# Altium project STM_POC.PrjPcb
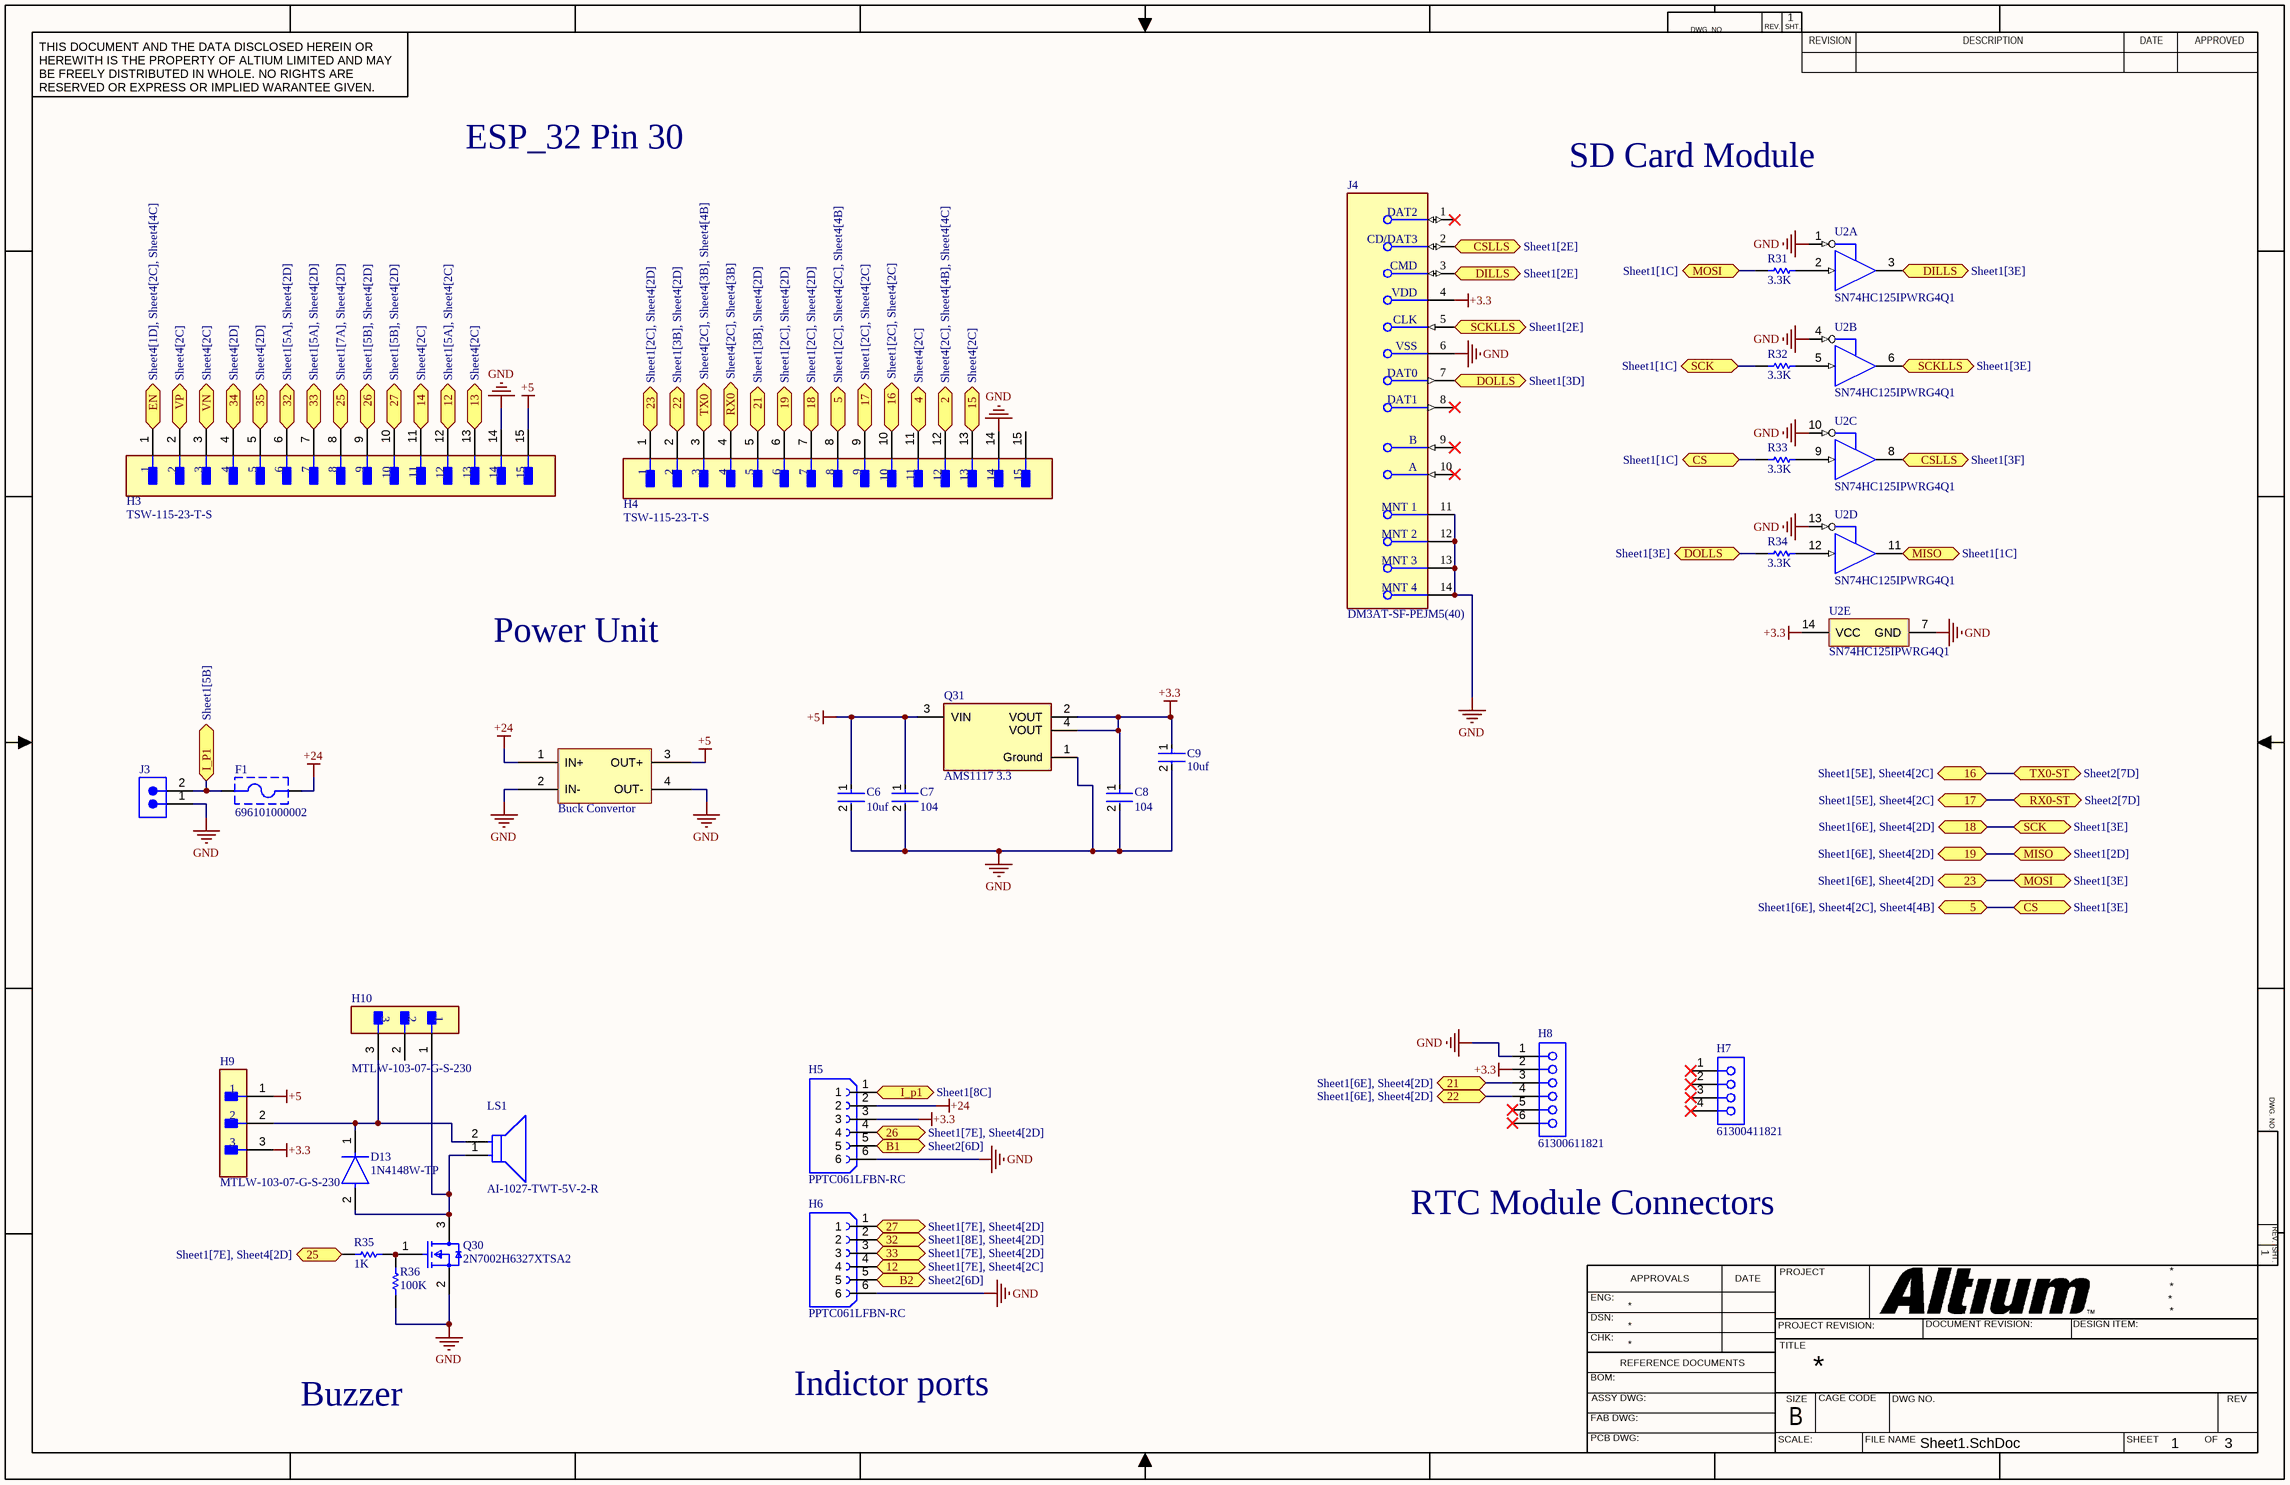
[diagram p0: Sheet1.SchDoc]
3 sheets, 82 parts. Net scope: flat (ports and power ports of the same name join across sheets).
Board file: PCB1.PcbDoc
Sheets:
  Sheet1.SchDoc
  Sheet2.SchDoc
  Sheet4.SchDoc

## Sheet Sheet1.SchDoc
size 431 x 279 mm; SheetNumber: 1; SheetTotal: 3

### Parts
*  Buck Convertor  [PCBComponent_1]
C6  10uf  [FP-GRM21B-0_1-MFG]
C7  104  [FP-GRM21B-0_1-MFG]
C8  104  [FP-GRM21B-0_1-MFG]
C9  10uf  [FP-GRM21B-0_1-MFG]
D13  1N4148W-TP  [FP-SOD-123-IPC_C]
F1  696101000002  [696101000002]
H3  TSW-115-23-T-S  [FP-TSW-115-23-T-S-MFG]
H4  TSW-115-23-T-S  [FP-TSW-115-23-T-S-MFG]
H5  PPTC061LFBN-RC  [SULLINS_PPTC061LFBN-RC]
H6  PPTC061LFBN-RC  [SULLINS_PPTC061LFBN-RC]
H7  61300411821  [61300411821]
H8  61300611821  [61300611821]
H9  MTLW-103-07-G-S-230  [FP-MTLW-103-07-G-S-230-MFG]
H10  MTLW-103-07-G-S-230  [FP-MTLW-103-07-G-S-230-MFG]
J3  691313510002  [691313510002]  (value not drawn)
J4  DM3AT-SF-PEJM5(40)  [FP-DM3AT-SF-PEJM5_40-MFG]
LS1  AI-1027-TWT-5V-2-R  [FP-AI-1027-TWT-5V-2-R-MFG]
Q30  2N7002H6327XTSA2  [FP-PG-SOT23-3-IPC_B]
Q31  AMS1117 3.3  [FP-AMS1117-IPC_A]
R31  3.3K  [RESC2013X70X40NL20T20]
R32  3.3K  [RESC2013X70X40NL20T20]
R33  3.3K  [RESC2013X70X40NL20T20]
R34  3.3K  [RESC2013X70X40NL20T20]
R35  1K  [RESC2013X70X40NL20T20]
R36  100K  [RESC2013X70X40NL20T20]
U2  SN74HC125IPWRG4Q1  [PW0014A_L]  (parts A,B,C,D,E of 5)

### Ports
2 (bidir, see Sheet4[2C], Sheet4[4B], Sheet4[4C]), 4 (bidir, see Sheet4[2C]), 5 (bidir, see Sheet1[2C], Sheet4[2C], Sheet4[4B]), 5 (bidir, see Sheet1[6E], Sheet4[2C], Sheet4[4B]), 12 (bidir, see Sheet1[5A], Sheet4[2C]), 12 (bidir, see Sheet1[7E], Sheet4[2C]), 13 (bidir, see Sheet4[2C]), 14 (bidir, see Sheet4[2C]), 15 (bidir, see Sheet4[2C]), 16 (bidir, see Sheet1[2C], Sheet4[2C]), 16 (bidir, see Sheet1[5E], Sheet4[2C]), 17 (bidir, see Sheet1[2C], Sheet4[2C]), 17 (bidir, see Sheet1[5E], Sheet4[2C]), 18 (bidir, see Sheet1[2C], Sheet4[2D]), 18 (bidir, see Sheet1[6E], Sheet4[2D]), 19 (bidir, see Sheet1[2C], Sheet4[2D]), 19 (bidir, see Sheet1[6E], Sheet4[2D]), 21 (bidir, see Sheet1[3B], Sheet4[2D]), 21 (bidir, see Sheet1[6E], Sheet4[2D]), 22 (bidir, see Sheet1[3B], Sheet4[2D]), 22 (bidir, see Sheet1[6E], Sheet4[2D]), 23 (bidir, see Sheet1[2C], Sheet4[2D]), 23 (bidir, see Sheet1[6E], Sheet4[2D]), 25 (bidir, see Sheet1[7A], Sheet4[2D]), 25 (bidir, see Sheet1[7E], Sheet4[2D]), 26 (bidir, see Sheet1[5B], Sheet4[2D]), 26 (bidir, see Sheet1[7E], Sheet4[2D]), 27 (bidir, see Sheet1[5B], Sheet4[2D]), 27 (bidir, see Sheet1[7E], Sheet4[2D]), 32 (bidir, see Sheet1[5A], Sheet4[2D]), 32 (bidir, see Sheet1[8E], Sheet4[2D]), 33 (bidir, see Sheet1[5A], Sheet4[2D]), 33 (bidir, see Sheet1[7E], Sheet4[2D]), 34 (bidir, see Sheet4[2D]), 35 (bidir, see Sheet4[2D]), B1 (bidir, see Sheet2[6D]), B2 (bidir, see Sheet2[6D]), CS (bidir, see Sheet1[1C]), CS (bidir, see Sheet1[3E]), CSLLS (bidir, see Sheet1[2E]), CSLLS (bidir, see Sheet1[3F]), DILLS (bidir, see Sheet1[2E]), DILLS (bidir, see Sheet1[3E]), DOLLS (bidir, see Sheet1[3D]), DOLLS (bidir, see Sheet1[3E]), EN (bidir, see Sheet4[1D], Sheet4[2C], Sheet4[4C]), I_P1 (bidir, see Sheet1[5B]), I_p1 (bidir, see Sheet1[8C]), MISO (bidir, see Sheet1[1C]), MISO (bidir, see Sheet1[2D]), MOSI (bidir, see Sheet1[1C]), MOSI (bidir, see Sheet1[3E]), RX0 (bidir, see Sheet4[2C], Sheet4[3B]), RX0-ST (bidir, see Sheet2[7D]), SCK (bidir, see Sheet1[1C]), SCK (bidir, see Sheet1[3E]), SCKLLS (bidir, see Sheet1[2E]), SCKLLS (bidir, see Sheet1[3E]), TX0 (bidir, see Sheet4[2C], Sheet4[3B], Sheet4[4B]), TX0-ST (bidir, see Sheet2[7D]), VN (bidir, see Sheet4[2C]), VP (bidir, see Sheet4[2C])

### Nets
+3.3: C8.1 C9.1 H5.3 H8.2 H9.3 J4.4(VDD) Q31.2(VOUT) Q31.4(VOUT) U2.14(VCC)
+5: *.3(OUT+) C6.1 C7.1 H3.15 H9.1 Q31.3(VIN)
+24: *.1(IN+) F1.2 H5.2
GND: *.2(IN-) *.4(OUT-) C6.2 C7.2 C8.2 C9.2 H3.14 H4.14 H5.6 H6.6 H8.1 J3.1 J4.6(VSS) J4.11(MNT_1) J4.12(MNT_2) J4.13(MNT_3) J4.14(MNT_4) Q30.2(source) Q31.1(Ground) R36.2 U2.1(1~{OE}) U2.4(2~{OE}) U2.7(GND) U2.10(3~{OE}) U2.13(4~{OE})
NetD3_2: H4.12 ; port 2
NetD13_1: D13.1(C) H9.2 H10.3 LS1.2(A)
NetD13_2: D13.2(A) H10.1 LS1.1(C) Q30.3(drain)
NetF1_1: F1.1 H5.1 J3.2 ; port I_P1, port I_p1
NetH1_13: H6.5 ; port B2
NetH1_16: H5.5 ; port B1
NetH2_43: H4.9 ; port 17, port RX0-ST
NetH2_44: H4.10 ; port 16, port TX0-ST
NetH3_1: H3.1 ; port EN
NetH3_2: H3.2 ; port VP
NetH3_3: H3.3 ; port VN
NetH3_4: H3.4 ; port 34
NetH3_5: H3.5 ; port 35
NetH3_6: H3.6 H6.2 ; port 32
NetH3_7: H3.7 H6.3 ; port 33
NetH3_8: H3.8 R35.2 ; port 25
NetH3_9: H3.9 H5.4 ; port 26
NetH3_10: H3.10 H6.1 ; port 27
NetH3_11: H3.11 ; port 14
NetH3_12: H3.12 H6.4 ; port 12
NetH3_13: H3.13 ; port 13
NetH4_1: H4.1 R31.2 ; port 23, port MOSI
NetH4_2: H4.2 H8.4 ; port 22
NetH4_3: H4.3 ; port TX0
NetH4_4: H4.4 ; port RX0
NetH4_5: H4.5 H8.3 ; port 21
NetH4_6: H4.6 U2.11(4Y) ; port 19, port MISO
NetH4_7: H4.7 R32.2 ; port 18, port SCK
NetH4_8: H4.8 R33.2 ; port 5, port CS
NetH4_11: H4.11 ; port 4
NetH4_13: H4.13 ; port 15
NetJ4_2: J4.2(CD/DAT3) U2.8(3Y) ; port CSLLS
NetJ4_3: J4.3(CMD) U2.3(1Y) ; port DILLS
NetJ4_5: J4.5(CLK) U2.6(2Y) ; port SCKLLS
NetJ4_7: J4.7(DAT0) R34.2 ; port DOLLS
NetQ30_1: Q30.1(gate) R35.1 R36.1
NetR31_1: R31.1 U2.2(1A)
NetR32_1: R32.1 U2.5(2A)
NetR33_1: R33.1 U2.9(3A)
NetR34_1: R34.1 U2.12(4A)

Not connected (* = marked no-connect by the designer): H4 15; H7 1* 2* 3* 4*; H8 5* 6*; H10 2; J4 1(DAT2)* 8(DAT1)* 9(B)* 10(A)*

### Notes on the sheet
- ESP_32 Pin 30
- SD Card Module
- Power Unit
- RTC Module Connectors
- Buzzer
- Indictor ports
- DWG. NO.
- REV.
- SHT.
- THIS DOCUMENT AND THE DATA DISCLOSED HEREIN OR HEREWITH IS THE PROPERTY OF ALTIUM LIMITED AND MAY BE FREELY DISTRIBUTED IN WHOLE. NO RIGHTS ARE RESERVED OR EXPRESS OR IMPLIED WARANTEE GIVEN.
- REVISION
- DESCRIPTION
- DATE
- APPROVED
- ENG:
- APPROVALS
- PROJECT
- DSN:
- CHK:
- REFERENCE DOCUMENTS
- PROJECT REVISION:
- TITLE
- DOCUMENT REVISION:
- DESIGN ITEM:
- BOM:
- FAB DWG:
- PCB DWG:
- ASSY DWG:
- SCALE:
- SIZE
- B
- CAGE CODE
- FILE NAME
- DWG NO.
- SHEET
- OF
- REV

### Library data of the parts
* = Component_1
C6-C9 = CMP-2007-03453-2: Chip Multilayer Ceramic Capacitors for General Purpose, 0805, 10uF, X5R, 15%, 10%, 16V; Radiation Hardening: No; Thickness: 0.053inch; Voltage Rating (DC): 16V; Lead Free: Lead Free; Package Quantity: 1; Width: 1.25mm; Case Code (Imperial): 0805; Depth: 1.25mm; Packaging: Tape and Reel; Dielectric: X5R; Max Operating Temperature: 85°C; Tolerance: 10%; Voltage Rating: 16V; Voltage: 16V; Capacitance: 10uF; Height: 1.25mm; Case Code (Metric): 2012; Material: Ceramic; Mount: Surface Mount; Case/Package: 0805; REACH SVHC: No SVHC; Length: 2mm; Min Operating Temperature: -55°C; Termination: SMD/SMT
D13 = CMP-2000-04993-2: DIODE GEN PURP 100V 150MA SOD123; Max Reverse Leakage Current: 5uA; Max Surge Current: 2A; Reverse Recovery Time: 4ns; Polarity: Standard; Capacitance: 4pF; Max Forward Surge Current (Ifsm): 1A; Element Configuration: Single; Power Dissipation: 400mW; Forward Voltage: 1V; Radiation Hardening: No; Lead Free: Lead Free; Max Reverse Voltage (DC): 100V; Current Rating: 150mA; Forward Current: 150mA; Packaging: Tape and Reel; Number of Pins: 2; Package Quantity: 3000; Max Operating Temperature: 150°C; Min Operating Temperature: -65°C; Average Rectified Current: 150mA; Recovery Time: 4ns; Output Current: 150mA; Peak Non-Repetitive Surge Current: 2A; Width: 1.8mm; Voltage Rating (DC): 100V; Height: 1.2mm; Max Repetitive Reverse Voltage (Vrrm): 100V; Mount: Surface Mount; Length: 2.85mm
F1 = CMP-1502-00233-4: WR-FSH Fuse Holder Blocks Fuse Holder Blocks Clip Cover for PCB; Fuse Current: 10A; Voltage Rating (AC): 250V; Mount: Through Hole; REACH SVHC: Unknown; RoHS: Compliant; Height: 13.6mm; Packaging: Box; Min Operating Temperature: -30°C; Max Operating Temperature: 120°C
H3 H4 = CMP-02766-001466-1: CONN HEADER VERT 15POS 2.54MM; Connector Type: Male Pin; Number of Contacts: 15; Gender: Male; Pitch: 0.1inch; Termination: Solder; Packaging: Bulk; Lead Free: Lead Free; Housing Color: Black; Housing Material: Plastic; Color: Black; RoHS Compliant: Yes; Contact Type: Male Pin; Width: 2.54mm; Mount: Through Hole; Contact Material: Bronze; Number of Rows: 1; Radiation Hardening: No; Number of Positions: 15; Length: 38.1mm; REACH SVHC: No SVHC; Height: 2.54mm; Contact Plating: Tin; Series: TSW; Contact Mating Length: 0.23inch
H5 H6 = PPTC061LFBN-RC: 6 Position Total Single Row 2.54 mm Pitch Straight Female Header; MF: Sullins Connector Solutions; MP: PPTC061LFBNRC; SnapEDA_Link: https://www.snapeda.com/parts/PPTC061LFBNRC/Sullins/view-part/?ref=snap; Package: None; Value: *; Check_prices: https://www.snapeda.com/parts/PPTC061LFBNRC/Sullins/view-part/?ref=eda
H7 = CMP-1502-01316-3: NexarPartId: 61924712; Contact Resistance: 20mΩ; Gender: Female; Current Rating: 3A; Operating Supply Voltage: 250V; RoHS: Non-Compliant; Number of Pins: 4; Orientation: Vertical; Lead Pitch: 2.54mm
H8 = CMP-1502-01322-3: NexarPartId: 21642411; Current Rating: 3A; Operating Supply Voltage: 250V; Contact Resistance: 20mΩ; Gender: Female; Number of Pins: 6; Orientation: Vertical; Lead Pitch: 2.54mm; RoHS: Compliant
H9 H10 = CMP-02766-001679-1: CONN HEADER VERT 3POS 2.54MM; Max Current Rating: 3A; Number of Contacts: 3; Gender: Male; Contact Material: Bronze; Pitch: 2.54mm; Housing Material: Polymer; Contact Plating: Gold; Radiation Hardening: No; Depth: 2.48mm; Packaging: Bulk; Number of Rows: 1; Max Operating Temperature: 125°C; Housing Color: Black; Termination: Solder; Min Operating Temperature: -55°C; Length: 7.62mm; RoHS Compliant: Yes; Orientation: Straight
J3 = CMP-1502-02192-3: 313; 5.08MM Pitch Straight Pluggable Term Block, Pcb Header, Through Hole, 2 Way; Number of Contacts: 2; Voltage: 300V; Number of Levels: 1; Gender: Male; Current: 20A; Pitch: 5.08mm; Number of Pins: 2; RoHS: Compliant; Length: 11.5mm; Width: 12.16mm; Packaging: Box; Max Operating Temperature: 105°C; Lead Pitch: 5.08mm; Mount: Through Hole; Color: Green; Number of Rows: 1; Voltage Rating: 300V; Contact Material: Tin; Height: 8.7mm; Contact Plating: Tin; Termination: Solder; Min Operating Temperature: -40°C; Number of Positions Per Level: 2; Current Rating: 20A
J4 = CMP-11597-000006-1: CONN MICRO SD R/A PUSH-PUSH SMD; Contact Resistance: 100mR; Insulation Resistance: 1GR; Gender: Receptacle; Max Voltage Rating (AC): 125V; Pitch: 1.1mm; Mating Cycles: 10000; Max Current Rating: 500mA; Connector Type: Connector; Number of Contacts: 8; Housing Material: Polymer; Flammability Rating: UL94 V-0; REACH SVHC: No SVHC; Lead Free: Lead Free; Package Quantity: 400; Length: 13.85mm; Number of Rows: 2; Series: DM3; Min Operating Temperature: -25°C; Voltage Rating (AC): 125V; Contact Material: Copper Alloy; Depth: 15.95mm; Contact Plating: Gold; Packaging: Tape and Reel; Width: 13.85mm; Orientation: Right Angle; Color: Black; Voltage Rating: 125V; Radiation Hardening: No; Termination: Solder; Current Rating: 500mA; Mount: Surface Mount; Max Operating Temperature: 85°C
LS1 = CMP-103888-000002-1: AUDIO MAGNETIC INDICATOR 3-7V TH; Input Type: DC; Frequency: 2.73kHz; Max Supply Voltage (DC): 7V; Max Supply Current: 30mA; Voltage Rating: 5V; Min Supply Voltage (DC): 3V; Max Operating Temperature: 70°C; Height: 5mm; Series: AI; Mount: Through Hole; Sensing Method: Magnetic; Packaging: Tray; Diameter: 9.6mm; Contact Plating: Gold; Termination: PC Pins; Operating Supply Current: 30mA; Min Operating Temperature: -20°C
Q30 = CMP-32901-000180-1: MOSFET N-CH 60V 0.3A SOT23; Rise Time: 3.3ns; Input Capacitance: 20pF; Rds On Max: 3R; Gate to Source Voltage (Vgs): 20V; Continuous Drain Current (ID): 300mA; Max Power Dissipation: 500mW; Packaging: Tape and Reel; Mount: Surface Mount; Case/Package: SOT-23; Drain to Source Voltage (Vdss): 60V; Min Operating Temperature: -55°C; Halogen Free: Halogen Free; Max Dual Supply Voltage: 60V; Number of Pins: 3; Lead Free: Lead Free; Max Operating Temperature: 150°C
Q31 = CMP-209535-000001-1: LDO Voltage Regulators 1A, 3.3V; Manufacturer Part Number: AMS1117-3.3; Manufacturer: Advanced Monolithic Systems; Dropout Voltage: 1.1V; Output Type: Fixed; Nominal Supply Current: 5mA; Max Power Dissipation: 1.2W; Max Supply Voltage: 15V; Number Of Outputs: 1; Standoff Height: 0.64mm; Max Junction Temp: +125°C; Height: 1.8mm; Package: AMS1117; Device Class L2: Power Management ICs; ComponentLink2Description: Datasheet; ComponentLink2URL: http://www.advanced-monolithic.com/pdf/ds1117.pdf; Category: IC; RoHS: TRUE; Automotive: No; Device Class L1: Integrated Circuits (ICs); Output Current: 1A; Device Class L3: Voltage Regulators - Linear; Temperature: -40°C to +125°C; Output Voltage: 3.3V; Temperature Range Low: -40°C; Octopart: https://octopart.com/ams1117-3.3-advanced+monolithic+systems-25899300; Lead Free: Yes; Ipc Land Pattern Name: SOT229P700X180-4; Temperature Range High: +125°C
R31-R36 = CMP-2001-04376-1: Manufacturer: Panasonic; Part Number: ERJ-6ENF1002V
U2 = CMP-0440-00197-3: Automotive Catalog Quadruple Bus Buffer Gates With 3-State Outputs, PW0014A, LARGE T&R; Generic Part Number: SN74HC125-Q1; Manufacturer: Texas Instruments; VCC(Min)(V): 2; tpd @ Nom Voltage(Max)(ns): 26; Input Type: CMOS; VCC(Max)(V): 6; Bits(#): 4; F @ Nom Voltage(Max)(Mhz): 28; ICC @ Nom Voltage(Max)(mA): 0.016; PackageVersion: http://www.ti.com/lit/ml/mpds360/mpds360.pdf; Operating Temperature Range(C): -40 to 85; PackageReference: PW0014A; Rating: Automotive; Voltage(Nom)(V): 6; DatasheetVersion: SCLS574A; Code_JEDEC: MO-153; Output Type: CMOS

## Sheet Sheet2.SchDoc
size 594 x 420 mm; SheetNumber: 2; SheetTotal: 3
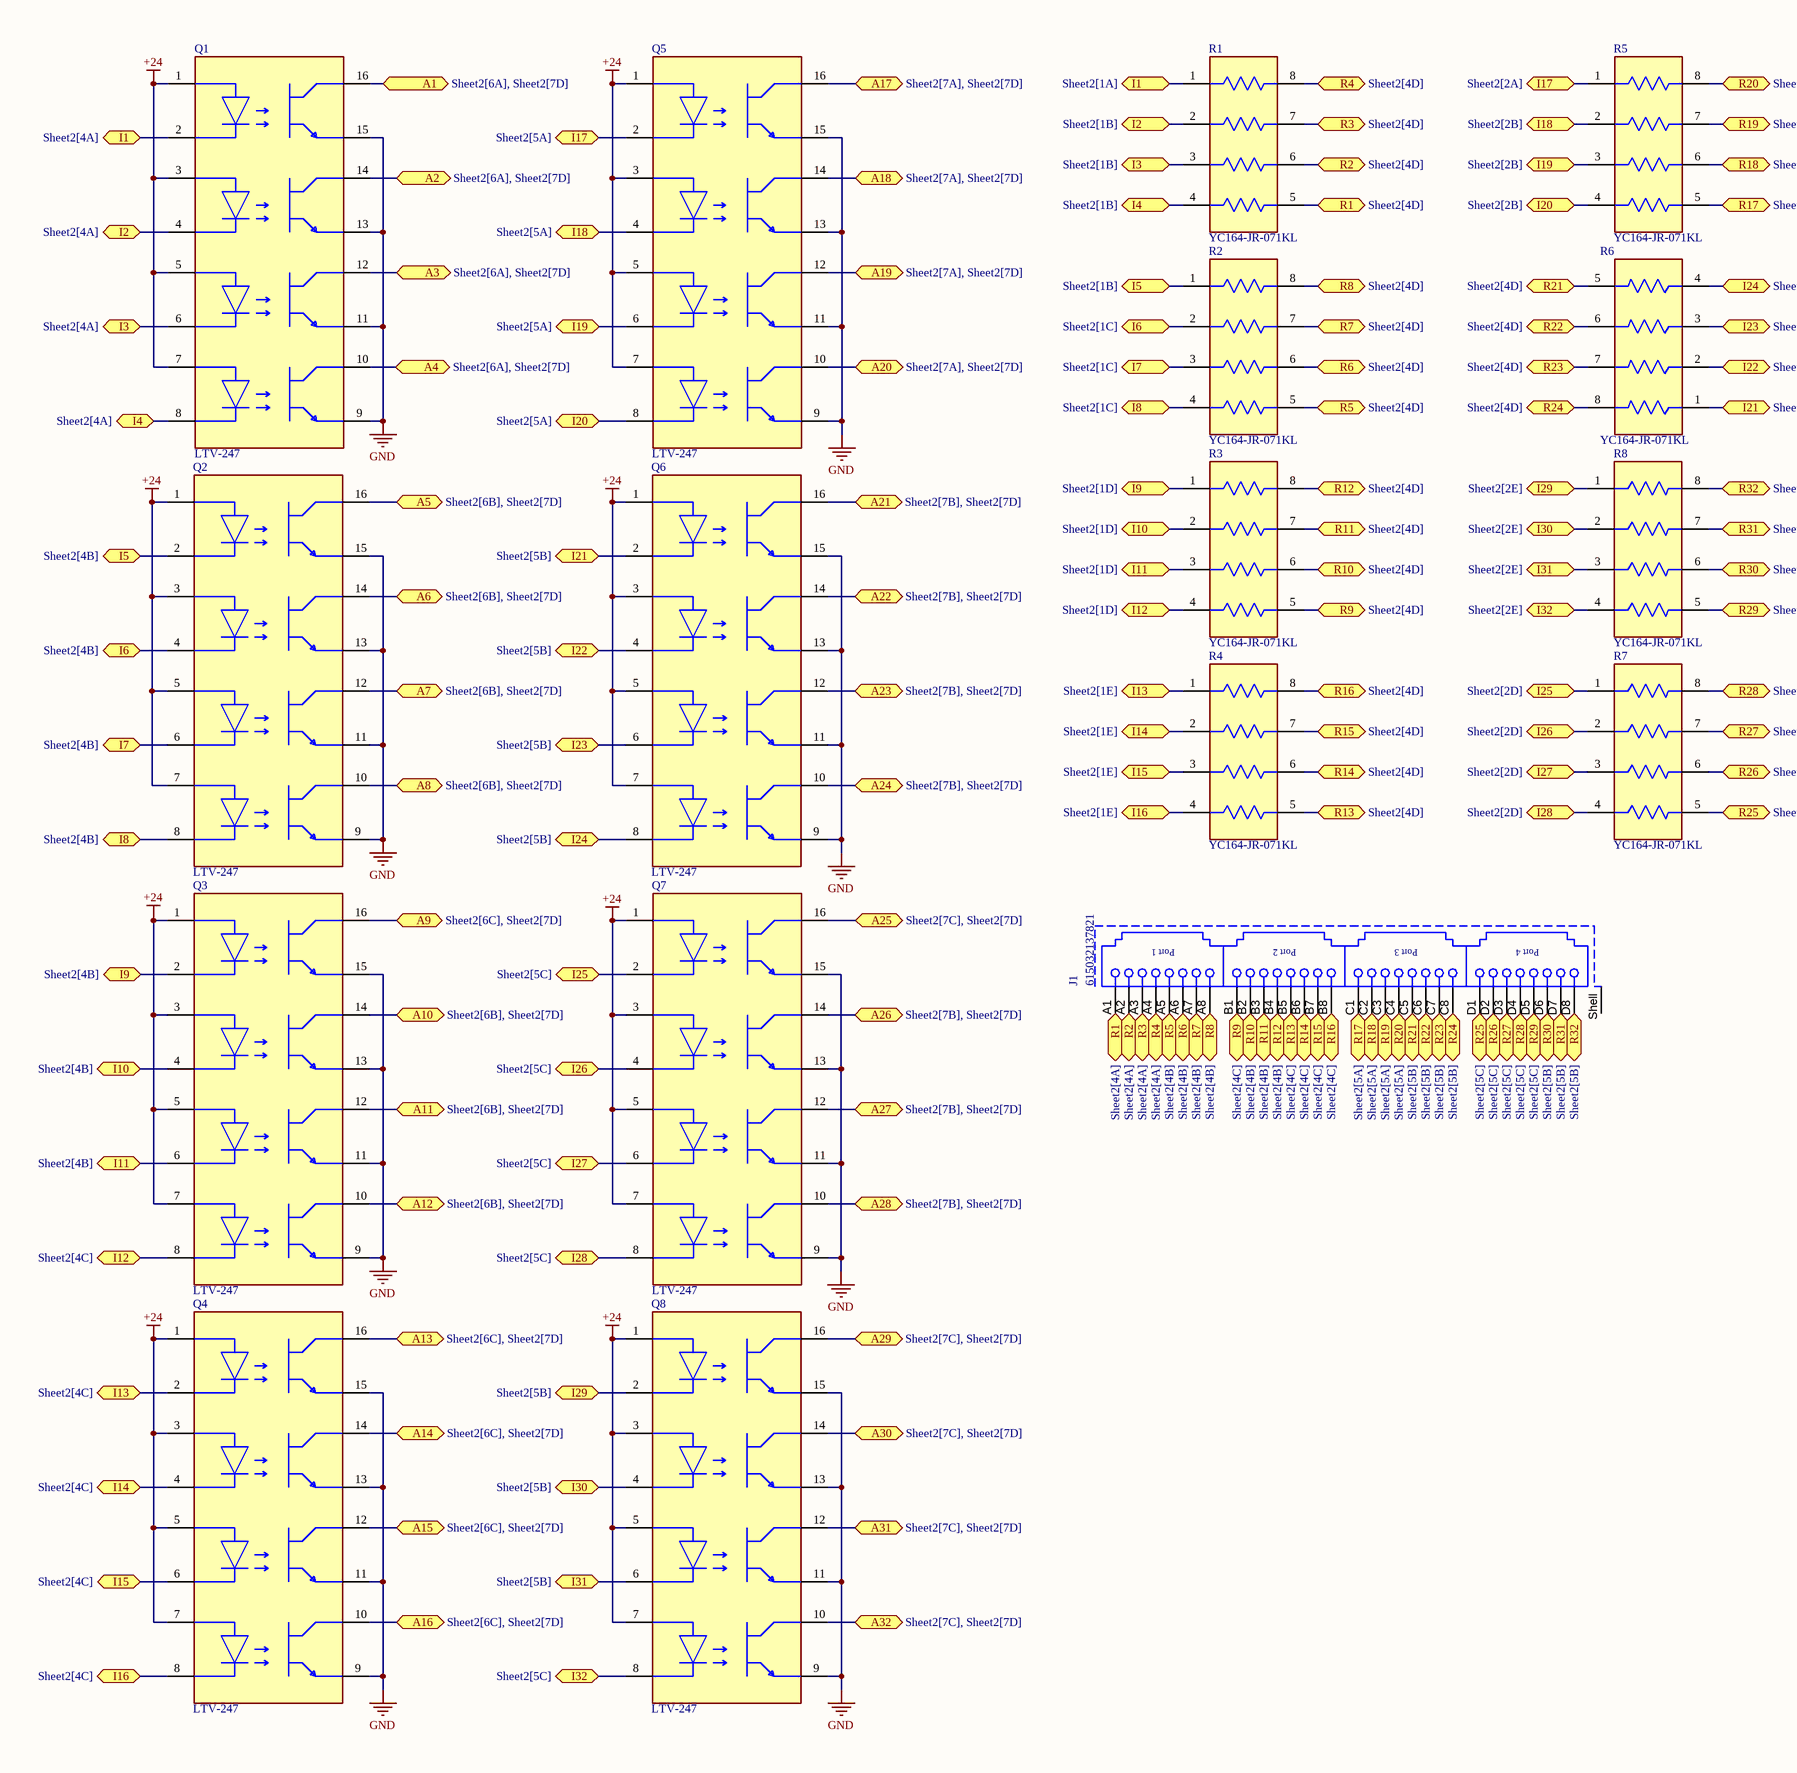
[diagram p1: Sheet2.SchDoc, left]
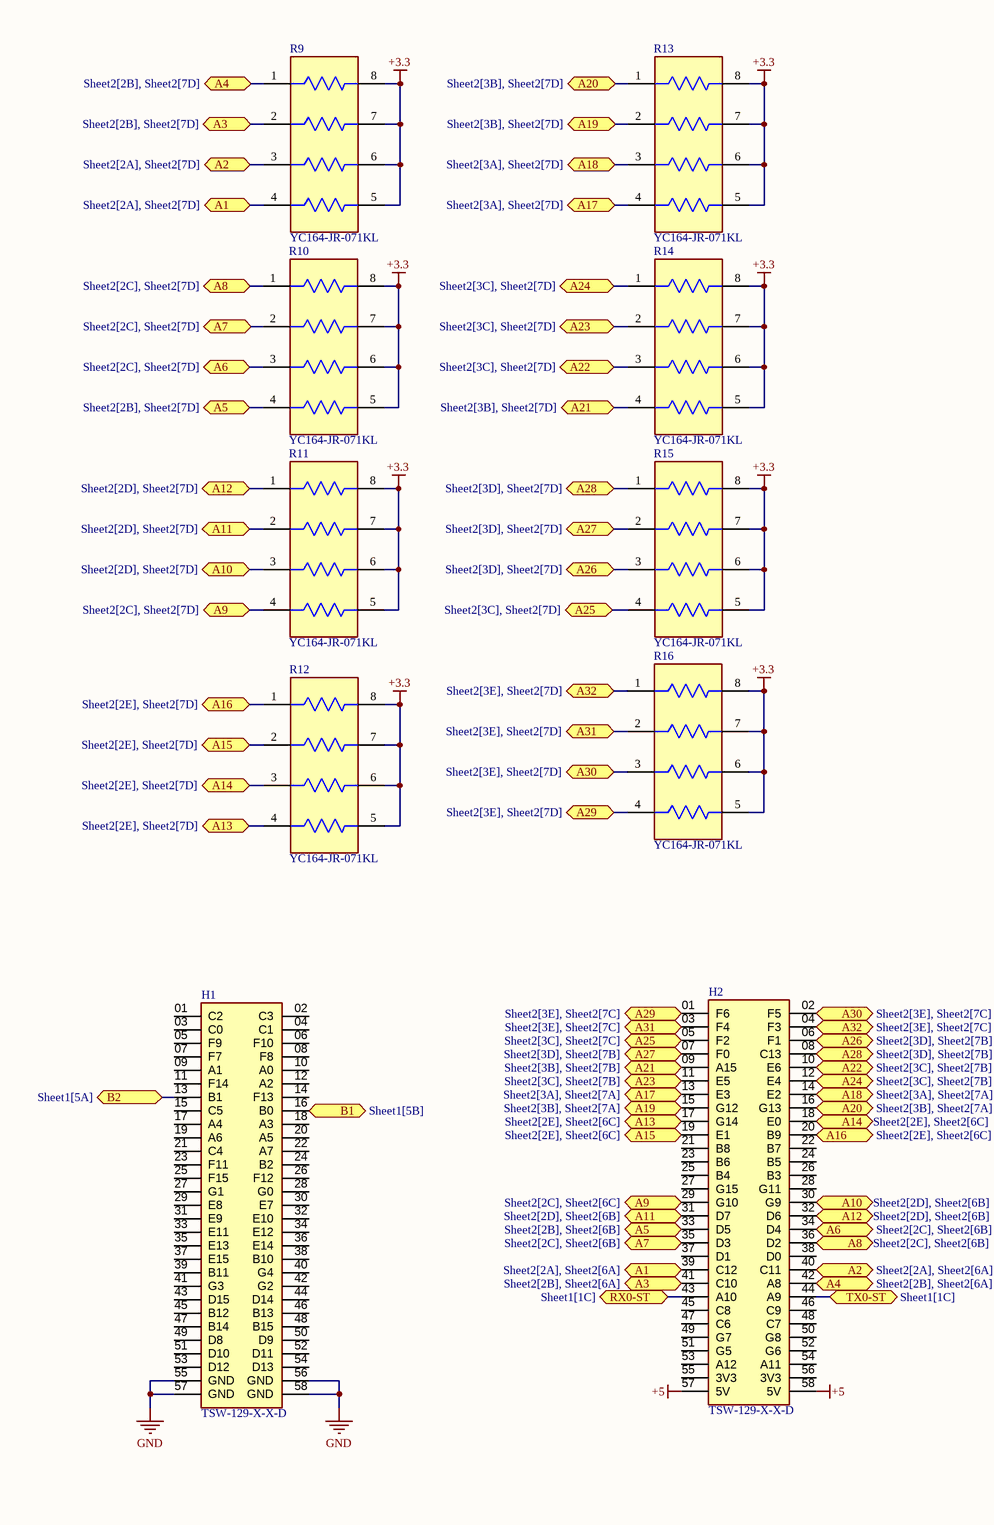
[diagram p2: Sheet2.SchDoc, right]

### Parts
H1  TSW-129-X-X-D  [SAMTEC_TSW-129-X-X-D]
H2  TSW-129-X-X-D  [SAMTEC_TSW-129-X-X-D]
J1  615032137821  [615032137821]
Q1  LTV-247  [FP-LTV-247-MFG]
Q2  LTV-247  [FP-LTV-247-MFG]
Q3  LTV-247  [FP-LTV-247-MFG]
Q4  LTV-247  [FP-LTV-247-MFG]
Q5  LTV-247  [FP-LTV-247-MFG]
Q6  LTV-247  [FP-LTV-247-MFG]
Q7  LTV-247  [FP-LTV-247-MFG]
Q8  LTV-247  [FP-LTV-247-MFG]
R1  YC164-JR-071KL  [FP-YC164-MFG]
R2  YC164-JR-071KL  [FP-YC164-MFG]
R3  YC164-JR-071KL  [FP-YC164-MFG]
R4  YC164-JR-071KL  [FP-YC164-MFG]
R5  YC164-JR-071KL  [FP-YC164-MFG]
R6  YC164-JR-071KL  [FP-YC164-MFG]
R7  YC164-JR-071KL  [FP-YC164-MFG]
R8  YC164-JR-071KL  [FP-YC164-MFG]
R9  YC164-JR-071KL  [FP-YC164-MFG]
R10  YC164-JR-071KL  [FP-YC164-MFG]
R11  YC164-JR-071KL  [FP-YC164-MFG]
R12  YC164-JR-071KL  [FP-YC164-MFG]
R13  YC164-JR-071KL  [FP-YC164-MFG]
R14  YC164-JR-071KL  [FP-YC164-MFG]
R15  YC164-JR-071KL  [FP-YC164-MFG]
R16  YC164-JR-071KL  [FP-YC164-MFG]

### Ports
A1 (bidir, see Sheet2[2A], Sheet2[6A]), A1 (bidir, see Sheet2[2A], Sheet2[7D]), A1 (bidir, see Sheet2[6A], Sheet2[7D]), A2 (bidir, see Sheet2[2A], Sheet2[6A]), A2 (bidir, see Sheet2[2A], Sheet2[7D]), A2 (bidir, see Sheet2[6A], Sheet2[7D]), A3 (bidir, see Sheet2[2B], Sheet2[6A]), A3 (bidir, see Sheet2[2B], Sheet2[7D]), A3 (bidir, see Sheet2[6A], Sheet2[7D]), A4 (bidir, see Sheet2[2B], Sheet2[6A]), A4 (bidir, see Sheet2[2B], Sheet2[7D]), A4 (bidir, see Sheet2[6A], Sheet2[7D]), A5 (bidir, see Sheet2[2B], Sheet2[6B]), A5 (bidir, see Sheet2[2B], Sheet2[7D]), A5 (bidir, see Sheet2[6B], Sheet2[7D]), A6 (bidir, see Sheet2[2C], Sheet2[6B]), A6 (bidir, see Sheet2[2C], Sheet2[7D]), A6 (bidir, see Sheet2[6B], Sheet2[7D]), A7 (bidir, see Sheet2[2C], Sheet2[6B]), A7 (bidir, see Sheet2[2C], Sheet2[7D]), A7 (bidir, see Sheet2[6B], Sheet2[7D]), A8 (bidir, see Sheet2[2C], Sheet2[6B]), A8 (bidir, see Sheet2[2C], Sheet2[7D]), A8 (bidir, see Sheet2[6B], Sheet2[7D]), A9 (bidir, see Sheet2[2C], Sheet2[6C]), A9 (bidir, see Sheet2[2C], Sheet2[7D]), A9 (bidir, see Sheet2[6C], Sheet2[7D]), A10 (bidir, see Sheet2[2D], Sheet2[6B]), A10 (bidir, see Sheet2[2D], Sheet2[7D]), A10 (bidir, see Sheet2[6B], Sheet2[7D]), A11 (bidir, see Sheet2[2D], Sheet2[6B]), A11 (bidir, see Sheet2[2D], Sheet2[7D]), A11 (bidir, see Sheet2[6B], Sheet2[7D]), A12 (bidir, see Sheet2[2D], Sheet2[6B]), A12 (bidir, see Sheet2[2D], Sheet2[7D]), A12 (bidir, see Sheet2[6B], Sheet2[7D]), A13 (bidir, see Sheet2[2E], Sheet2[6C]), A13 (bidir, see Sheet2[2E], Sheet2[7D]), A13 (bidir, see Sheet2[6C], Sheet2[7D]), A14 (bidir, see Sheet2[2E], Sheet2[6C]), A14 (bidir, see Sheet2[2E], Sheet2[7D]), A14 (bidir, see Sheet2[6C], Sheet2[7D]), A15 (bidir, see Sheet2[2E], Sheet2[6C]), A15 (bidir, see Sheet2[2E], Sheet2[7D]), A15 (bidir, see Sheet2[6C], Sheet2[7D]), A16 (bidir, see Sheet2[2E], Sheet2[6C]), A16 (bidir, see Sheet2[2E], Sheet2[7D]), A16 (bidir, see Sheet2[6C], Sheet2[7D]), A17 (bidir, see Sheet2[3A], Sheet2[7A]), A17 (bidir, see Sheet2[3A], Sheet2[7D]), A17 (bidir, see Sheet2[7A], Sheet2[7D]), A18 (bidir, see Sheet2[3A], Sheet2[7A]), A18 (bidir, see Sheet2[3A], Sheet2[7D]), A18 (bidir, see Sheet2[7A], Sheet2[7D]), A19 (bidir, see Sheet2[3B], Sheet2[7A]), A19 (bidir, see Sheet2[3B], Sheet2[7D]), A19 (bidir, see Sheet2[7A], Sheet2[7D]), A20 (bidir, see Sheet2[3B], Sheet2[7A]), A20 (bidir, see Sheet2[3B], Sheet2[7D]), A20 (bidir, see Sheet2[7A], Sheet2[7D]), A21 (bidir, see Sheet2[3B], Sheet2[7B]), A21 (bidir, see Sheet2[3B], Sheet2[7D]), A21 (bidir, see Sheet2[7B], Sheet2[7D]), A22 (bidir, see Sheet2[3C], Sheet2[7B]), A22 (bidir, see Sheet2[3C], Sheet2[7D]), A22 (bidir, see Sheet2[7B], Sheet2[7D]), A23 (bidir, see Sheet2[3C], Sheet2[7B]), A23 (bidir, see Sheet2[3C], Sheet2[7D]), A23 (bidir, see Sheet2[7B], Sheet2[7D]), A24 (bidir, see Sheet2[3C], Sheet2[7B]), A24 (bidir, see Sheet2[3C], Sheet2[7D]), A24 (bidir, see Sheet2[7B], Sheet2[7D]), A25 (bidir, see Sheet2[3C], Sheet2[7C]), A25 (bidir, see Sheet2[3C], Sheet2[7D]), A25 (bidir, see Sheet2[7C], Sheet2[7D]), A26 (bidir, see Sheet2[3D], Sheet2[7B]), A26 (bidir, see Sheet2[3D], Sheet2[7D]), A26 (bidir, see Sheet2[7B], Sheet2[7D]), A27 (bidir, see Sheet2[3D], Sheet2[7B]), A27 (bidir, see Sheet2[3D], Sheet2[7D]), A27 (bidir, see Sheet2[7B], Sheet2[7D]), A28 (bidir, see Sheet2[3D], Sheet2[7B]), A28 (bidir, see Sheet2[3D], Sheet2[7D]), A28 (bidir, see Sheet2[7B], Sheet2[7D]), A29 (bidir, see Sheet2[3E], Sheet2[7C]), A29 (bidir, see Sheet2[3E], Sheet2[7D]), A29 (bidir, see Sheet2[7C], Sheet2[7D]), A30 (bidir, see Sheet2[3E], Sheet2[7C]), A30 (bidir, see Sheet2[3E], Sheet2[7D]), A30 (bidir, see Sheet2[7C], Sheet2[7D]), A31 (bidir, see Sheet2[3E], Sheet2[7C]), A31 (bidir, see Sheet2[3E], Sheet2[7D]), A31 (bidir, see Sheet2[7C], Sheet2[7D]), A32 (bidir, see Sheet2[3E], Sheet2[7C]), A32 (bidir, see Sheet2[3E], Sheet2[7D]), A32 (bidir, see Sheet2[7C], Sheet2[7D]), B1 (bidir, see Sheet1[5B]), B2 (bidir, see Sheet1[5A]), I1 (bidir, see Sheet2[1A]), I1 (bidir, see Sheet2[4A]), I2 (bidir, see Sheet2[1B]), I2 (bidir, see Sheet2[4A]), I3 (bidir, see Sheet2[1B]), I3 (bidir, see Sheet2[4A]), I4 (bidir, see Sheet2[1B]), I4 (bidir, see Sheet2[4A]), I5 (bidir, see Sheet2[1B]), I5 (bidir, see Sheet2[4B]), I6 (bidir, see Sheet2[1C]), I6 (bidir, see Sheet2[4B]), I7 (bidir, see Sheet2[1C]), I7 (bidir, see Sheet2[4B]), I8 (bidir, see Sheet2[1C]), I8 (bidir, see Sheet2[4B]), I9 (bidir, see Sheet2[1D]), I9 (bidir, see Sheet2[4B]), I10 (bidir, see Sheet2[1D]), I10 (bidir, see Sheet2[4B]), I11 (bidir, see Sheet2[1D]), I11 (bidir, see Sheet2[4B]), I12 (bidir, see Sheet2[1D]), I12 (bidir, see Sheet2[4C]), I13 (bidir, see Sheet2[1E]), I13 (bidir, see Sheet2[4C]), I14 (bidir, see Sheet2[1E]), I14 (bidir, see Sheet2[4C]), I15 (bidir, see Sheet2[1E]), I15 (bidir, see Sheet2[4C]), I16 (bidir, see Sheet2[1E]), I16 (bidir, see Sheet2[4C]), I17 (bidir, see Sheet2[2A]), I17 (bidir, see Sheet2[5A]), I18 (bidir, see Sheet2[2B]), I18 (bidir, see Sheet2[5A]), I19 (bidir, see Sheet2[2B]), I19 (bidir, see Sheet2[5A]), I20 (bidir, see Sheet2[2B]), I20 (bidir, see Sheet2[5A]), I21 (bidir, see Sheet2[2B]), I21 (bidir, see Sheet2[5B]), I22 (bidir, see Sheet2[2C]), I22 (bidir, see Sheet2[5B]), I23 (bidir, see Sheet2[2C]), I23 (bidir, see Sheet2[5B]), I24 (bidir, see Sheet2[2C]), I24 (bidir, see Sheet2[5B]), I25 (bidir, see Sheet2[2D]), I25 (bidir, see Sheet2[5C]), I26 (bidir, see Sheet2[2D]), I26 (bidir, see Sheet2[5C]), I27 (bidir, see Sheet2[2D]), I27 (bidir, see Sheet2[5C]), I28 (bidir, see Sheet2[2D]), I28 (bidir, see Sheet2[5C]), I29 (bidir, see Sheet2[2E]), I29 (bidir, see Sheet2[5B]), I30 (bidir, see Sheet2[2E]), I30 (bidir, see Sheet2[5B]), I31 (bidir, see Sheet2[2E]), I31 (bidir, see Sheet2[5B]), I32 (bidir, see Sheet2[2E]), I32 (bidir, see Sheet2[5C]), R1 (bidir, see Sheet2[4A]), R1 (bidir, see Sheet2[4D]), R2 (bidir, see Sheet2[4A]), R2 (bidir, see Sheet2[4D]), R3 (bidir, see Sheet2[4A]), R3 (bidir, see Sheet2[4D]), R4 (bidir, see Sheet2[4A]), R4 (bidir, see Sheet2[4D]), R5 (bidir, see Sheet2[4B]), R5 (bidir, see Sheet2[4D]), R6 (bidir, see Sheet2[4B]), R6 (bidir, see Sheet2[4D]), R7 (bidir, see Sheet2[4B]), R7 (bidir, see Sheet2[4D]), R8 (bidir, see Sheet2[4B]), R8 (bidir, see Sheet2[4D]), R9 (bidir, see Sheet2[4C]), R9 (bidir, see Sheet2[4D]), R10 (bidir, see Sheet2[4B]), R10 (bidir, see Sheet2[4D]), R11 (bidir, see Sheet2[4B]), R11 (bidir, see Sheet2[4D]), R12 (bidir, see Sheet2[4B]), R12 (bidir, see Sheet2[4D]), R13 (bidir, see Sheet2[4C]), R13 (bidir, see Sheet2[4D]), R14 (bidir, see Sheet2[4C]), R14 (bidir, see Sheet2[4D]), R15 (bidir, see Sheet2[4C]), R15 (bidir, see Sheet2[4D]), R16 (bidir, see Sheet2[4C]), R16 (bidir, see Sheet2[4D]), R17 (bidir, see Sheet2[4D]), R17 (bidir, see Sheet2[5A]), R18 (bidir, see Sheet2[4D]), R18 (bidir, see Sheet2[5A]), R19 (bidir, see Sheet2[4D]), R19 (bidir, see Sheet2[5A]), R20 (bidir, see Sheet2[4D]), R20 (bidir, see Sheet2[5A]), R21 (bidir, see Sheet2[4D]), R21 (bidir, see Sheet2[5B]), R22 (bidir, see Sheet2[4D]), R22 (bidir, see Sheet2[5B]), R23 (bidir, see Sheet2[4D]), R23 (bidir, see Sheet2[5B]), R24 (bidir, see Sheet2[4D]), R24 (bidir, see Sheet2[5B]), R25 (bidir, see Sheet2[4D]), R25 (bidir, see Sheet2[5C]), R26 (bidir, see Sheet2[4D]), R26 (bidir, see Sheet2[5C]), R27 (bidir, see Sheet2[5C]), R27 (bidir, see Sheet2[5D]), R28 (bidir, see Sheet2[5C]), R28 (bidir, see Sheet2[5D]), R29 (bidir, see Sheet2[5C]), R29 (bidir, see Sheet2[5D]), R30 (bidir, see Sheet2[5B]), R30 (bidir, see Sheet2[5D]), R31 (bidir, see Sheet2[5B]), R31 (bidir, see Sheet2[5D]), R32 (bidir, see Sheet2[5B]), R32 (bidir, see Sheet2[5D]), RX0-ST (bidir, see Sheet1[1C]), TX0-ST (bidir, see Sheet1[1C])

### Nets
+3.3: R9.5 R9.6 R9.7 R9.8 R10.5 R10.6 R10.7 R10.8 R11.5 R11.6 R11.7 R11.8 R12.5 R12.6 R12.7 R12.8 R13.5 R13.6 R13.7 R13.8 R14.5 R14.6 R14.7 R14.8 R15.5 R15.6 R15.7 R15.8 R16.5 R16.6 R16.7 R16.8
+5: H2.57(5V) H2.58(5V)
+24: Q1.1(1_ANODE) Q1.3(2_ANODE) Q1.5(3_ANODE) Q1.7(4_ANODE) Q2.1(1_ANODE) Q2.3(2_ANODE) Q2.5(3_ANODE) Q2.7(4_ANODE) Q3.1(1_ANODE) Q3.3(2_ANODE) Q3.5(3_ANODE) Q3.7(4_ANODE) Q4.1(1_ANODE) Q4.3(2_ANODE) Q4.5(3_ANODE) Q4.7(4_ANODE) Q5.1(1_ANODE) Q5.3(2_ANODE) Q5.5(3_ANODE) Q5.7(4_ANODE) Q6.1(1_ANODE) Q6.3(2_ANODE) Q6.5(3_ANODE) Q6.7(4_ANODE) Q7.1(1_ANODE) Q7.3(2_ANODE) Q7.5(3_ANODE) Q7.7(4_ANODE) Q8.1(1_ANODE) Q8.3(2_ANODE) Q8.5(3_ANODE) Q8.7(4_ANODE)
GND: H1.55(GND) H1.56(GND) H1.57(GND) H1.58(GND) Q1.9(E) Q1.11(E) Q1.13(E) Q1.15(E) Q2.9(E) Q2.11(E) Q2.13(E) Q2.15(E) Q3.9(E) Q3.11(E) Q3.13(E) Q3.15(E) Q4.9(E) Q4.11(E) Q4.13(E) Q4.15(E) Q5.9(E) Q5.11(E) Q5.13(E) Q5.15(E) Q6.9(E) Q6.11(E) Q6.13(E) Q6.15(E) Q7.9(E) Q7.11(E) Q7.13(E) Q7.15(E) Q8.9(E) Q8.11(E) Q8.13(E) Q8.15(E)
NetH1_13: H1.13(B1) ; port B2
NetH1_16: H1.16(B0) ; port B1
NetH2_01: H2.01(F6) Q8.16(C) R16.4 ; port A29
NetH2_02: H2.02(F5) Q8.14(C) R16.3 ; port A30
NetH2_03: H2.03(F4) Q8.12(C) R16.2 ; port A31
NetH2_04: H2.04(F3) Q8.10(C) R16.1 ; port A32
NetH2_05: H2.05(F2) Q7.16(C) R15.4 ; port A25
NetH2_06: H2.06(F1) Q7.14(C) R15.3 ; port A26
NetH2_07: H2.07(F0) Q7.12(C) R15.2 ; port A27
NetH2_08: H2.08(C13) Q7.10(C) R15.1 ; port A28
NetH2_09: H2.09(A15) Q6.16(C) R14.4 ; port A21
NetH2_10: H2.10(E6) Q6.14(C) R14.3 ; port A22
NetH2_11: H2.11(E5) Q6.12(C) R14.2 ; port A23
NetH2_12: H2.12(E4) Q6.10(C) R14.1 ; port A24
NetH2_13: H2.13(E3) Q5.16(C) R13.4 ; port A17
NetH2_14: H2.14(E2) Q5.14(C) R13.3 ; port A18
NetH2_15: H2.15(G12) Q5.12(C) R13.2 ; port A19
NetH2_16: H2.16(G13) Q5.10(C) R13.1 ; port A20
NetH2_17: H2.17(G14) Q4.16(C) R12.4 ; port A13
NetH2_18: H2.18(E0) Q4.14(C) R12.3 ; port A14
NetH2_19: H2.19(E1) Q4.12(C) R12.2 ; port A15
NetH2_20: H2.20(B9) Q4.10(C) R12.1 ; port A16
NetH2_29: H2.29(G10) Q3.16(C) R11.4 ; port A9
NetH2_30: H2.30(G9) Q3.14(C) R11.3 ; port A10
NetH2_31: H2.31(D7) Q3.12(C) R11.2 ; port A11
NetH2_32: H2.32(D6) Q3.10(C) R11.1 ; port A12
NetH2_33: H2.33(D5) Q2.16(C) R10.4 ; port A5
NetH2_34: H2.34(D4) Q2.14(C) R10.3 ; port A6
NetH2_35: H2.35(D3) Q2.12(C) R10.2 ; port A7
NetH2_36: H2.36(D2) Q2.10(C) R10.1 ; port A8
NetH2_39: H2.39(C12) Q1.16(C) R9.4 ; port A1
NetH2_40: H2.40(C11) Q1.14(C) R9.3 ; port A2
NetH2_41: H2.41(C10) Q1.12(C) R9.2 ; port A3
NetH2_42: H2.42(A8) Q1.10(C) R9.1 ; port A4
NetH2_43: H2.43(A10) ; port RX0-ST
NetH2_44: H2.44(A9) ; port TX0-ST
NetJ1_A1: J1.A1 R1.5 ; port R1
NetJ1_A2: J1.A2 R1.6 ; port R2
NetJ1_A3: J1.A3 R1.7 ; port R3
NetJ1_A4: J1.A4 R1.8 ; port R4
NetJ1_A5: J1.A5 R2.5 ; port R5
NetJ1_A6: J1.A6 R2.6 ; port R6
NetJ1_A7: J1.A7 R2.7 ; port R7
NetJ1_A8: J1.A8 R2.8 ; port R8
NetJ1_B1: J1.B1 R3.5 ; port R9
NetJ1_B2: J1.B2 R3.6 ; port R10
NetJ1_B3: J1.B3 R3.7 ; port R11
NetJ1_B4: J1.B4 R3.8 ; port R12
NetJ1_B5: J1.B5 R4.5 ; port R13
NetJ1_B6: J1.B6 R4.6 ; port R14
NetJ1_B7: J1.B7 R4.7 ; port R15
NetJ1_B8: J1.B8 R4.8 ; port R16
NetJ1_C1: J1.C1 R5.5 ; port R17
NetJ1_C2: J1.C2 R5.6 ; port R18
NetJ1_C3: J1.C3 R5.7 ; port R19
NetJ1_C4: J1.C4 R5.8 ; port R20
NetJ1_C5: J1.C5 R6.5 ; port R21
NetJ1_C6: J1.C6 R6.6 ; port R22
NetJ1_C7: J1.C7 R6.7 ; port R23
NetJ1_C8: J1.C8 R6.8 ; port R24
NetJ1_D1: J1.D1 R7.5 ; port R25
NetJ1_D2: J1.D2 R7.6 ; port R26
NetJ1_D3: J1.D3 R7.7 ; port R27
NetJ1_D4: J1.D4 R7.8 ; port R28
NetJ1_D5: J1.D5 R8.5 ; port R29
NetJ1_D6: J1.D6 R8.6 ; port R30
NetJ1_D7: J1.D7 R8.7 ; port R31
NetJ1_D8: J1.D8 R8.8 ; port R32
NetQ1_2: Q1.2(1_CATHODE) R1.1 ; port I1
NetQ1_4: Q1.4(2_CATHODE) R1.2 ; port I2
NetQ1_6: Q1.6(3_CATHODE) R1.3 ; port I3
NetQ1_8: Q1.8(4_CATHODE) R1.4 ; port I4
NetQ2_2: Q2.2(1_CATHODE) R2.1 ; port I5
NetQ2_4: Q2.4(2_CATHODE) R2.2 ; port I6
NetQ2_6: Q2.6(3_CATHODE) R2.3 ; port I7
NetQ2_8: Q2.8(4_CATHODE) R2.4 ; port I8
NetQ3_2: Q3.2(1_CATHODE) R3.1 ; port I9
NetQ3_4: Q3.4(2_CATHODE) R3.2 ; port I10
NetQ3_6: Q3.6(3_CATHODE) R3.3 ; port I11
NetQ3_8: Q3.8(4_CATHODE) R3.4 ; port I12
NetQ4_2: Q4.2(1_CATHODE) R4.1 ; port I13
NetQ4_4: Q4.4(2_CATHODE) R4.2 ; port I14
NetQ4_6: Q4.6(3_CATHODE) R4.3 ; port I15
NetQ4_8: Q4.8(4_CATHODE) R4.4 ; port I16
NetQ5_2: Q5.2(1_CATHODE) R5.1 ; port I17
NetQ5_4: Q5.4(2_CATHODE) R5.2 ; port I18
NetQ5_6: Q5.6(3_CATHODE) R5.3 ; port I19
NetQ5_8: Q5.8(4_CATHODE) R5.4 ; port I20
NetQ6_2: Q6.2(1_CATHODE) R6.1 ; port I21
NetQ6_4: Q6.4(2_CATHODE) R6.2 ; port I22
NetQ6_6: Q6.6(3_CATHODE) R6.3 ; port I23
NetQ6_8: Q6.8(4_CATHODE) R6.4 ; port I24
NetQ7_2: Q7.2(1_CATHODE) R7.1 ; port I25
NetQ7_4: Q7.4(2_CATHODE) R7.2 ; port I26
NetQ7_6: Q7.6(3_CATHODE) R7.3 ; port I27
NetQ7_8: Q7.8(4_CATHODE) R7.4 ; port I28
NetQ8_2: Q8.2(1_CATHODE) R8.1 ; port I29
NetQ8_4: Q8.4(2_CATHODE) R8.2 ; port I30
NetQ8_6: Q8.6(3_CATHODE) R8.3 ; port I31
NetQ8_8: Q8.8(4_CATHODE) R8.4 ; port I32

Not connected (* = marked no-connect by the designer): H1 01(C2) 02(C3) 03(C0) 04(C1) 05(F9) 06(F10) 07(F7) 08(F8) 09(A1) 10(A0) 11(F14) 12(A2) 14(F13) 15(C5) 17(A4) 18(A3) 19(A6) 20(A5) 21(C4) 22(A7) 23(F11) 24(B2) 25(F15) 26(F12) 27(G1) 28(G0) 29(E8) 30(E7) 31(E9) 32(E10) 33(E11) 34(E12) 35(E13) 36(E14) 37(E15) 38(B10) 39(B11) 40(G4) 41(G3) 42(G2) 43(D15) 44(D14) 45(B12) 46(B13) 47(B14) 48(B15) 49(D8) 50(D9) 51(D10) 52(D11) 53(D12) 54(D13); H2 21(B8) 22(B7) 23(B6) 24(B5) 25(B4) 26(B3) 27(G15) 28(G11) 37(D1) 38(D0) 45(C8) 46(C9) 47(C6) 48(C7) 49(G7) 50(G8) 51(G5) 52(G6) 53(A12) 54(A11) 55(3V3) 56(3V3); J1 Shell

### Notes on the sheet
- DWG NO:
- REV:
- THIS DOCUMENT AND THE DATA DISCLOSED HEREIN OR
- HEREWITH IS THE PROPERTY OF ALTIUM LIMITED AND MAY
- BE FREELY DISTRIBUTED IN WHOLE. NO RIGHTS ARE
- RESERVED OR EXPRESS OR IMPLIED WARANTEE GIVEN.
- REVISION
- DESCRIPTION
- DATE
- APPROVED
- ENG:
- APPROVALS
- PROJECT
- DSN:
- CHK:
- REFERENCE DOCUMENTS
- PROJECT REVISION:
- TITLE
- DOCUMENT REVISION:
- DESIGN ITEM:
- BOM:
- FAB DWG:
- PCB DWG:
- ASSY DWG:
- SCALE:
- A2
- SIZE
- CAGE CODE
- FILE NAME
- DWG NO.
- SHEET
- OF
- REV
- (in symbol CMP-1502-01711-3) Port 1; Port 2; Port 3; Port 4

### Library data of the parts
H1 H2 = TSW-129-X-X-D: Connector Header Through Hole 58 position 0.100 (2.54mm); MF: Samtec; MP: TSW-129-16-T-D; SnapEDA_Link: https://www.snapeda.com/parts/TSW-129-16-T-D/Samtec/view-part/?ref=snap; Package: None; Value: *; Check_prices: https://www.snapeda.com/parts/TSW-129-16-T-D/Samtec/view-part/?ref=eda
J1 = CMP-1502-01711-3: Modular Jack WR-MJ, Tab Down, Shielded, Ganged 4 Ports, Horizontal Entry, THT, 8P8C; Operating Supply Voltage: 120V; Number of Positions: 8; Insulation Resistance: 500MΩ; Current Rating: 1.5A; Connector Type: RJ45; Contact Resistance: 20mΩ; Gender: Male; Number of Ports: 4; Min Operating Temperature: -40°C; Insulation Material: PBT; Contact Plating: Gold; REACH SVHC: Unknown; RoHS: Compliant; Termination: Through Hole; Max Operating Temperature: 85°C; Number of Contacts: 8; Mount: Through Hole
Q1-Q8 = CMP-22018-000010-1: OPTOISO 3.75KV 4CH TRANS 16SO; Forward Voltage: 1.2V; Collector Emitter Voltage (VCEO): 80V; Forward Current: 20mA; Output Current per Channel: 50mA; Power Dissipation: 170mW; Reverse Breakdown Voltage: 6V; Max Power Dissipation: 200mW; Current Transfer Ratio: 600%; Number of Elements: 4; Collector Emitter Saturation Voltage: 400mV; Package Quantity: 2000; Mount: Surface Mount; Max Operating Temperature: 110°C; Packaging: Tape and Reel; RoHS Compliant: Yes; Case/Package: SMD/SMT; Number of Pins: 16; Min Operating Temperature: -55°C; Max Output Voltage: 80V; Number of Channels: 4; Radiation Hardening: No; Max Input Current: 50mA; Max Collector Current: 50mA
R1-R16 = CMP-03411-000004-1: RES ARRAY 4 RES 1K OHM 1206; Number of Terminals/Pins: 8; Resistance Tolerance: 5%; Temperature Coefficient: 200ppm/°C; Number of Circuits: 4; Resistance: 1kR; Power Per Element: 62.5mW; Voltage Rating: 50V; Circuit Type: Isolated; Case/Package: 0603; RoHS Compliant: Yes; Size Code: 0603; Tolerance: 5%; Min Operating Temperature: -55°C; Height: 0.028inch; Series: YC164; Number of Elements: 4; Length: 0.126inch; Number of Pins: 8; Number of Resistors: 4; Lead Free: Lead Free; Radiation Hardening: No; Max Operating Temperature: 155°C; Case Code (Metric): 3216; Working Voltage: 50V; Case Code (Imperial): 1206; Packaging: Cut Tape; Technology: THICK FILM; Number of Contacts: 8; Width: 0.063inch; Depth: 1.6mm; Terminal Pitch: 0.8mm; Power Dissipation: 62.5mW; Package Quantity: 1; Termination: Convex; Mount: Surface Mount; Military Standard: Not

## Sheet Sheet4.SchDoc
size A4; SheetNumber: 3; SheetTotal: 3
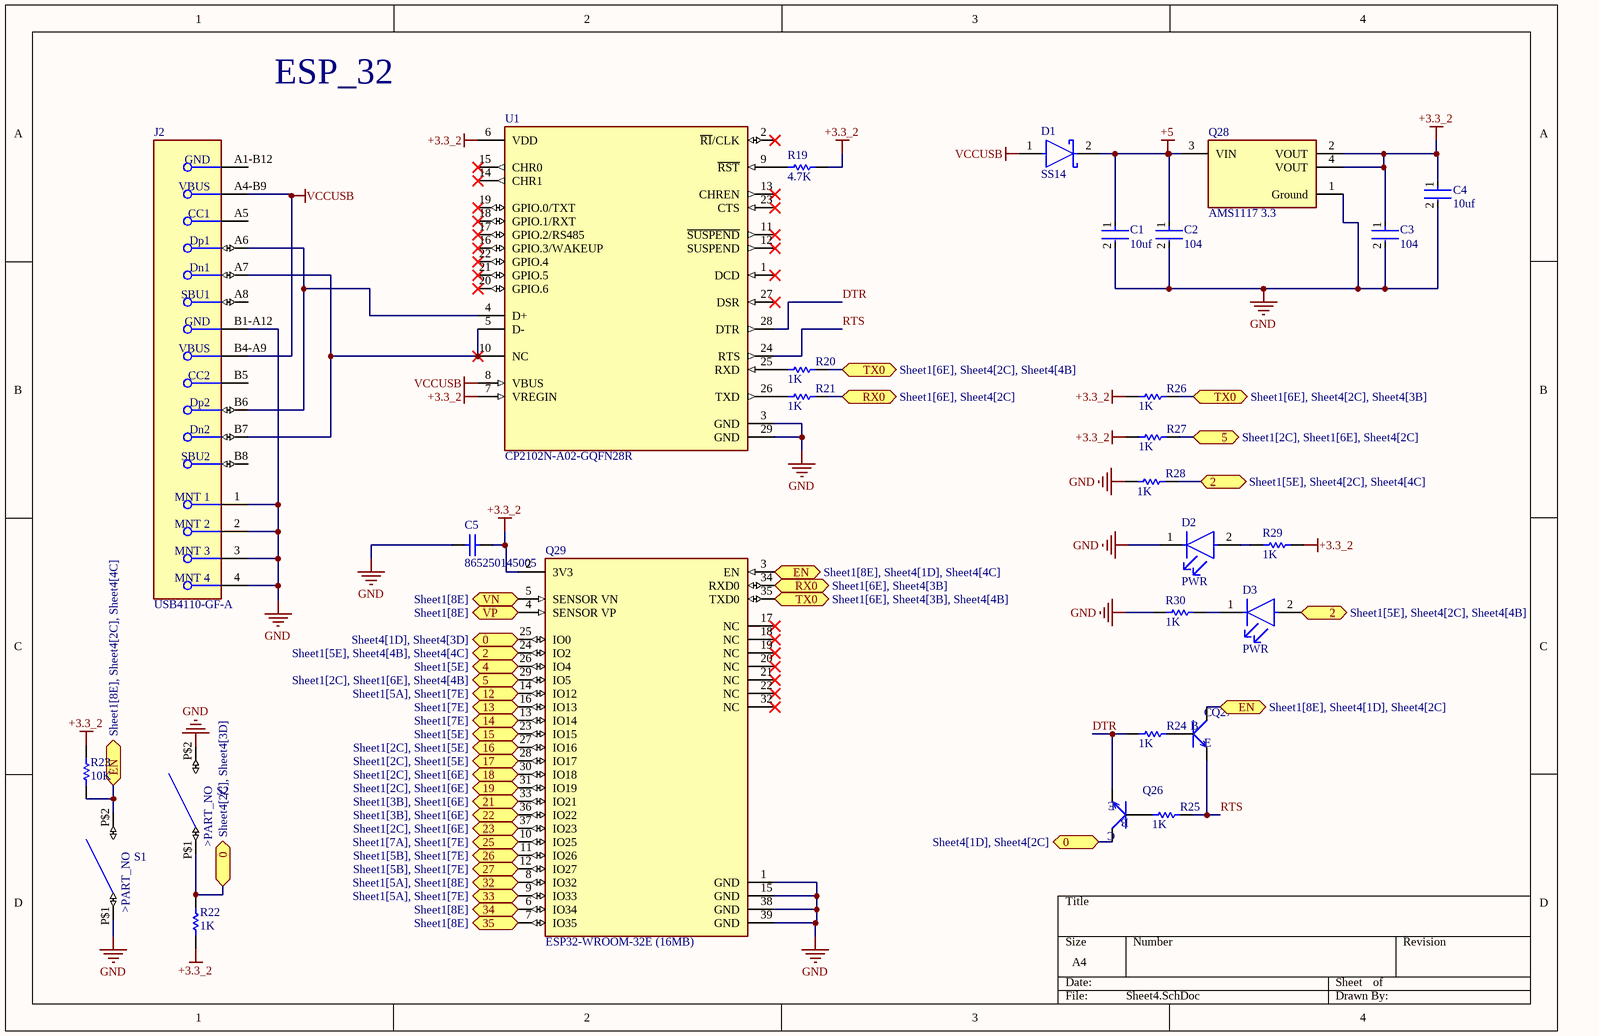
[diagram p3: Sheet4.SchDoc]

### Parts
C1  10uf  [FP-GRM21B-0_1-MFG]
C2  104  [FP-GRM21B-0_1-MFG]
C3  104  [FP-GRM21B-0_1-MFG]
C4  10uf  [FP-GRM21B-0_1-MFG]
C5  865250145005  [WCAP-ASNP_D6.3H7.7]
D1  SS14  [FP-403AE-MFG]
D2  PWR  [FP-KP-2012QBC-D-MFG]
D3  PWR  [FP-KP-2012QBC-D-MFG]
J2  USB4110-GF-A  [FP-USB4110-GF-A-MFG]
Q26  SMD-TRANSISTORS-NPN-25V-500MW(SOT-23)  [SOT-23]  (value not drawn)
Q27  SMD-TRANSISTORS-NPN-25V-500MW(SOT-23)  [SOT-23]  (value not drawn)
Q28  AMS1117 3.3  [FP-AMS1117-IPC_A]
Q29  ESP32-WROOM-32E (16MB)  [FP-ESP32-WROOM-32E_16MB-MFG]
R19  4.7K  [RESC2013X70X40NL20T20]
R20  1K  [RESC2013X70X40NL20T20]
R21  1K  [RESC2013X70X40NL20T20]
R22  1K  [RESC2013X70X40NL20T20]
R23  10K  [RESC2013X70X40NL20T20]
R24  1K  [RESC2013X70X40NL20T20]
R25  1K  [RESC2013X70X40NL20T20]
R26  1K  [RESC2013X70X40NL20T20]
R27  1K  [RESC2013X70X40NL20T20]
R28  1K  [RESC2013X70X40NL20T20]
R29  1K  [RESC2013X70X40NL20T20]
R30  1K  [RESC2013X70X40NL20T20]
S1  PTS636SP43SMTRLFS  [PTS636SP43SMTRLFS]  (value not drawn)
S2  PTS636SP43SMTRLFS  [PTS636SP43SMTRLFS]  (value not drawn)
U1  CP2102N-A02-GQFN28R  [FP-CP2102N-A02-GQFN28R-IPC_B]

### Ports
0 (bidir, see Sheet4[1D], Sheet4[2C]), 0 (bidir, see Sheet4[1D], Sheet4[3D]), 0 (bidir, see Sheet4[2C], Sheet4[3D]), 2 (bidir, see Sheet1[5E], Sheet4[2C], Sheet4[4B]), 2 (bidir, see Sheet1[5E], Sheet4[2C], Sheet4[4C]), 2 (bidir, see Sheet1[5E], Sheet4[4B], Sheet4[4C]), 4 (bidir, see Sheet1[5E]), 5 (bidir, see Sheet1[2C], Sheet1[6E], Sheet4[2C]), 5 (bidir, see Sheet1[2C], Sheet1[6E], Sheet4[4B]), 12 (bidir, see Sheet1[5A], Sheet1[7E]), 13 (bidir, see Sheet1[7E]), 14 (bidir, see Sheet1[7E]), 15 (bidir, see Sheet1[5E]), 16 (bidir, see Sheet1[2C], Sheet1[5E]), 17 (bidir, see Sheet1[2C], Sheet1[5E]), 18 (bidir, see Sheet1[2C], Sheet1[6E]), 19 (bidir, see Sheet1[2C], Sheet1[6E]), 21 (bidir, see Sheet1[3B], Sheet1[6E]), 22 (bidir, see Sheet1[3B], Sheet1[6E]), 23 (bidir, see Sheet1[2C], Sheet1[6E]), 25 (bidir, see Sheet1[7A], Sheet1[7E]), 26 (bidir, see Sheet1[5B], Sheet1[7E]), 27 (bidir, see Sheet1[5B], Sheet1[7E]), 32 (bidir, see Sheet1[5A], Sheet1[8E]), 33 (bidir, see Sheet1[5A], Sheet1[7E]), 34 (bidir, see Sheet1[8E]), 35 (bidir, see Sheet1[8E]), EN (bidir, see Sheet1[8E], Sheet4[1D], Sheet4[2C]), EN (bidir, see Sheet1[8E], Sheet4[1D], Sheet4[4C]), EN (bidir, see Sheet1[8E], Sheet4[2C], Sheet4[4C]), RX0 (bidir, see Sheet1[6E], Sheet4[2C]), RX0 (bidir, see Sheet1[6E], Sheet4[3B]), TX0 (bidir, see Sheet1[6E], Sheet4[2C], Sheet4[3B]), TX0 (bidir, see Sheet1[6E], Sheet4[2C], Sheet4[4B]), TX0 (bidir, see Sheet1[6E], Sheet4[3B], Sheet4[4B]), VN (bidir, see Sheet1[8E]), VP (bidir, see Sheet1[8E])

### Nets
+3.3_2: C3.1 C4.1 C5.2 Q28.2(VOUT) Q28.4(VOUT) Q29.2(3V3) R19.1 R22.2 R23.1 R26.2 R27.2 R29.2 U1.6(VDD) U1.7(VREGIN)
+5: C1.1 C2.1 D1.2(C) Q28.3(VIN)
GND: C1.2 C2.2 C3.2 C4.2 C5.1 D2.1(C) J2.1(MNT_1) J2.2(MNT_2) J2.3(MNT_3) J2.4(MNT_4) J2.B1-A12(GND) Q28.1(Ground) Q29.1(GND) Q29.15(GND) Q29.38(GND) Q29.39(GND) R28.2 R30.1 S1.P$1 S2.P$2 U1.3(GND) U1.29(GND)
VCCUSB: D1.1(A) J2.A4-B9(VBUS) J2.B4-A9(VBUS) U1.8(VBUS)
DTR: Q26.2(E) R24.2 U1.28(DTR)
RTS: Q27.2(E) R25.1 U1.24(RTS)
NetD2_2: D2.2(A) R29.1
NetD3_1: D3.1(C) R30.2
NetD3_2: D3.2(A) Q29.24(IO2) R28.1 ; port 2
NetH2_43: Q29.28(IO17) ; port 17
NetH2_44: Q29.27(IO16) ; port 16
NetH3_1: Q27.3(C) Q29.3(EN) R23.2 S1.P$2 ; port EN
NetH3_2: Q29.4(SENSOR_VP) ; port VP
NetH3_3: Q29.5(SENSOR_VN) ; port VN
NetH3_4: Q29.6(IO34) ; port 34
NetH3_5: Q29.7(IO35) ; port 35
NetH3_6: Q29.8(IO32) ; port 32
NetH3_7: Q29.9(IO33) ; port 33
NetH3_8: Q29.10(IO25) ; port 25
NetH3_9: Q29.11(IO26) ; port 26
NetH3_10: Q29.12(IO27) ; port 27
NetH3_11: Q29.13(IO14) ; port 14
NetH3_12: Q29.14(IO12) ; port 12
NetH3_13: Q29.16(IO13) ; port 13
NetH4_1: Q29.37(IO23) ; port 23
NetH4_2: Q29.36(IO22) ; port 22
NetH4_3: Q29.35(TXD0) R20.1 R26.1 ; port TX0
NetH4_4: Q29.34(RXD0) R21.1 ; port RX0
NetH4_5: Q29.33(IO21) ; port 21
NetH4_6: Q29.31(IO19) ; port 19
NetH4_7: Q29.30(IO18) ; port 18
NetH4_8: Q29.29(IO5) R27.1 ; port 5
NetH4_11: Q29.26(IO4) ; port 4
NetH4_13: Q29.23(IO15) ; port 15
NetJ2_A6: J2.A6(Dp1) J2.B6(Dp2) U1.4(D+)
NetJ2_A7: J2.A7(Dn1) J2.B7(Dn2) U1.5(D-) U1.10(NC)
NetQ26_1: Q26.1(B) R25.2
NetQ26_3: Q26.3(C) Q29.25(IO0) R22.1 S2.P$1 ; port 0
NetQ27_1: Q27.1(B) R24.1
NetR19_2: R19.2 U1.9(~{RST})
NetR20_2: R20.2 U1.25(RXD)
NetR21_2: R21.2 U1.26(TXD)

Not connected (* = marked no-connect by the designer): J2 A1-B12(GND) A5(CC1) A8(SBU1) B5(CC2) B8(SBU2); Q29 17(NC)* 18(NC)* 19(NC)* 20(NC)* 21(NC)* 22(NC)* 32(NC)*; U1 1(DCD)* 2(~{RI}/CLK)* 11(~{SUSPEND})* 12(SUSPEND)* 13(CHREN)* 14(CHR1)* 15(CHR0)* 16(GPIO.3/WAKEUP)* 17(GPIO.2/RS485)* 18(GPIO.1/RXT)* 19(GPIO.0/TXT)* 20(GPIO.6)* 21(GPIO.5)* 22(GPIO.4)* 23(CTS)* 27(DSR)*

### Notes on the sheet
- ESP_32
- (in symbol PTS636SP43SMTRLFS) >PART_NO

### Library data of the parts
C1-C4 = CMP-2007-03453-2: as C6 on sheet Sheet1; Radiation Hardening: No; Thickness: 0.053inch; Voltage Rating (DC): 16V; Lead Free: Lead Free; Package Quantity: 1; Width: 1.25mm; Case Code (Imperial): 0805; Depth: 1.25mm; Packaging: Tape and Reel; Dielectric: X5R; Max Operating Temperature: 85°C; Tolerance: 10%; Voltage Rating: 16V; Voltage: 16V; Capacitance: 10uF; Height: 1.25mm; Case Code (Metric): 2012; Material: Ceramic; Mount: Surface Mount; Case/Package: 0805; REACH SVHC: No SVHC; Length: 2mm; Min Operating Temperature: -55°C; Termination: SMD/SMT
C5 = CMP-03913-53758703-1: 865250145005 SMD Aluminium Electrolytic Capacitor, WCAP-ASNP Series, 100 F, 6.3 V, Radial Can - SMD, 6.3 mm; Impedance: 463.097mΩ; Ripple Current (AC): 65mA; Life (Hours): 2000hours; Voltage Rating: 6.3V; Insulation Resistance: 1MΩ; Tolerance: 20%; Capacitance: 100µF; Polarity: Polar; Leakage Current: 31.5µA; Width: 6.6mm; Height - Seated (Max): 7.6962mm; RoHS: Compliant; REACH SVHC: Unknown; Length: 7.7mm; Max Operating Temperature: 85°C; Case/Package: Radial; Diameter: 6.3mm; NexarPartId: 53758703; Min Operating Temperature: -40°C; Ripple Current: 65mA; Mount: Surface Mount; Packaging: Tape & Reel (TR); Voltage Rating (DC): 6.3V; Height: 7.7mm
D1 = CMP-2000-04943-2: DIODE SCHOTTKY 40V 1A SMA; Manufacturer: ON Semiconductor; Peak Reverse Current: 0.2mA; Max Junction Temp: +125°C; Standoff Height: 0.05mm; Max Surge Forward Current: 40A; Mouser Description: Schottky Diodes & Rectifiers SMA 40V 1.0A; RoHS: TRUE; Lead Free: Yes; Manufacturer Part Number: SS14; Device Class L3: Schottky Diodes; Category: Diode; Automotive: No; Digikey Description: DIODE SCHOTTKY 40V 1A SMA; ComponentLink2Description: Datasheet; Device Class L2: Diodes; Height: 2.5mm; Temperature Range High: +125°C; ComponentLink2URL: https://www.onsemi.com/pub/Collateral/SS19-D.PDF; Device Class L1: Discrete Semiconductors; Package: 403AE; Octopart: https://octopart.com/ss14-on+semiconductor-29205033; Max Repetitive Reverse Voltage: 40V; Temperature Range Low: -65°C; Forward Current: 1A; Temperature: -65°C to +125°C
D2 D3 = CMP-44529-000058-1: LED, Low Power, Blue, SMD, 0805 [2012 Metric], 20 mA, 3.3 V, 465 nm; Wavelength: 465nm; Lens Color: Clear; Number of LEDs: 1; Viewing Angle: 120°; Luminous Intensity: 100mcd; Dominant Wavelength: 470nm; Forward Voltage: 3.3V; Lens Style: Diffused; Forward Current: 20mA; Color: Blue; Packaging: Tape and Reel; Width: 2mm; Number of Pins: 2; Radiation Hardening: No; Series: KP; Length: 1.25mm; REACH SVHC: No SVHC; Case/Package: 2012; Mount: Surface Mount; Height: 1.1mm; RoHS Compliant: Yes
J2 = CMP-245163-000002-1: CONN USB 2.0 TYPE-C R/A SMT; Manufacturer: GCT; Conn Orientation: Right Angle; Usb Standard: USB 2.0; Voltage Rating: 20V; Current Rating: 3/4.25/1.25/0.25A; Number Of Contacts: 16; Is Female: yes; Shielding: true; Standoff Height: 0.1mm; Octopart: https://octopart.com/usb4110-gf-a-gct-103941985; Temperature: -40°C to +85°C; RoHS: TRUE; Automotive: No; Contact Material: Gold,Nickel; Device Class L1: Connectors; Device Class L2: USB Connectors; Package: 0; Lead Free: Yes; ComponentLink2URL: https://gct.co/files/drawings/usb4110.pdf; Temperature Range High: +85°C; Temperature Range Low: -40°C; Height: 3.46mm; Manufacturer Part Number: USB4110-GF-A; ComponentLink2Description: Datasheet; Device Class L3: unset; Digikey Description: CONN USB 2.0 TYPE-C R/A SMT; Category: Conn
Q26 Q27 = SMD-TRANSISTORS-NPN-25V-500MW(SOT-23): Bipolar (BJT) Transistor NPN 25 V 500 mA 150MHz 300 mW Surface Mount SOT-23; MF: UMW; MP: S8050; Purchase-URL: https://pricing.snapeda.com/search/part/S8050/?ref=eda; Check_prices: https://www.snapeda.com/parts/S8050/Umwelt+Sensor+Teknik/view-part/?ref=eda; SnapEDA_Link: https://www.snapeda.com/parts/S8050/Umwelt+Sensor+Teknik/view-part/?ref=snap; Price: None; Availability: In Stock; Package: None; Value: *
Q28 = CMP-209535-000001-1: as Q31 on sheet Sheet1; Height: 1.8mm; Package: AMS1117; Device Class L2: Power Management ICs; ComponentLink2Description: Datasheet; ComponentLink2URL: http://www.advanced-monolithic.com/pdf/ds1117.pdf; Category: IC; RoHS: TRUE; Automotive: No; Device Class L1: Integrated Circuits (ICs); Output Current: 1A; Device Class L3: Voltage Regulators - Linear; Temperature: -40°C to +125°C; Output Voltage: 3.3V; Temperature Range Low: -40°C; Octopart: https://octopart.com/ams1117-3.3-advanced+monolithic+systems-25899300; Lead Free: Yes; Ipc Land Pattern Name: SOT229P700X180-4; Temperature Range High: +125°C
Q29 = CMP-194065-000027-1: RX TXRX MOD WIFI TRACE ANT SMD
R19-R30 = CMP-2001-04376-1: as R31 on sheet Sheet1
S1 S2 = PTS636SP43SMTRLFS: MF: C&K Components; Package: None; Price: None; Value: *; SnapEDA_Link: https://www.snapeda.com/parts/PTS636SP43SMTRLFS/C%2526K+Components/view-part/?ref=snap; MP: PTS636SP43SMTRLFS; Availability: In Stock; Check_prices: https://www.snapeda.com/parts/PTS636SP43SMTRLFS/C%2526K+Components/view-part/?ref=eda
U1 = CMP-08093-000007-1: IC USB TO UART BRIDGE QFN28

## Nets that join several sheets
+3.3: Sheet1 (9 pins), Sheet2 (32 pins)
+5: Sheet1 (6 pins), Sheet2 (H2.57 H2.58), Sheet4 (C1.1 C2.1 D1.2 Q28.3)
+24: Sheet1 (*.1 F1.2 H5.2), Sheet2 (32 pins)
GND: Sheet1 (25 pins), Sheet2 (36 pins), Sheet4 (22 pins)
NetD3_2: Sheet1 (H4.12), Sheet4 (D3.2 Q29.24 R28.1)
NetH1_13: Sheet1 (H6.5), Sheet2 (H1.13)
NetH1_16: Sheet1 (H5.5), Sheet2 (H1.16)
NetH2_43: Sheet1 (H4.9), Sheet2 (H2.43), Sheet4 (Q29.28)
NetH2_44: Sheet1 (H4.10), Sheet2 (H2.44), Sheet4 (Q29.27)
NetH3_1: Sheet1 (H3.1), Sheet4 (Q27.3 Q29.3 R23.2 S1.P$2)
NetH3_2: Sheet1 (H3.2), Sheet4 (Q29.4)
NetH3_3: Sheet1 (H3.3), Sheet4 (Q29.5)
NetH3_4: Sheet1 (H3.4), Sheet4 (Q29.6)
NetH3_5: Sheet1 (H3.5), Sheet4 (Q29.7)
NetH3_6: Sheet1 (H3.6 H6.2), Sheet4 (Q29.8)
NetH3_7: Sheet1 (H3.7 H6.3), Sheet4 (Q29.9)
NetH3_8: Sheet1 (H3.8 R35.2), Sheet4 (Q29.10)
NetH3_9: Sheet1 (H3.9 H5.4), Sheet4 (Q29.11)
NetH3_10: Sheet1 (H3.10 H6.1), Sheet4 (Q29.12)
NetH3_11: Sheet1 (H3.11), Sheet4 (Q29.13)
NetH3_12: Sheet1 (H3.12 H6.4), Sheet4 (Q29.14)
NetH3_13: Sheet1 (H3.13), Sheet4 (Q29.16)
NetH4_1: Sheet1 (H4.1 R31.2), Sheet4 (Q29.37)
NetH4_2: Sheet1 (H4.2 H8.4), Sheet4 (Q29.36)
NetH4_3: Sheet1 (H4.3), Sheet4 (Q29.35 R20.1 R26.1)
NetH4_4: Sheet1 (H4.4), Sheet4 (Q29.34 R21.1)
NetH4_5: Sheet1 (H4.5 H8.3), Sheet4 (Q29.33)
NetH4_6: Sheet1 (H4.6 U2.11), Sheet4 (Q29.31)
NetH4_7: Sheet1 (H4.7 R32.2), Sheet4 (Q29.30)
NetH4_8: Sheet1 (H4.8 R33.2), Sheet4 (Q29.29 R27.1)
NetH4_11: Sheet1 (H4.11), Sheet4 (Q29.26)
NetH4_13: Sheet1 (H4.13), Sheet4 (Q29.23)